# Altium schematic sheet Doggy.SchDoc
size A4
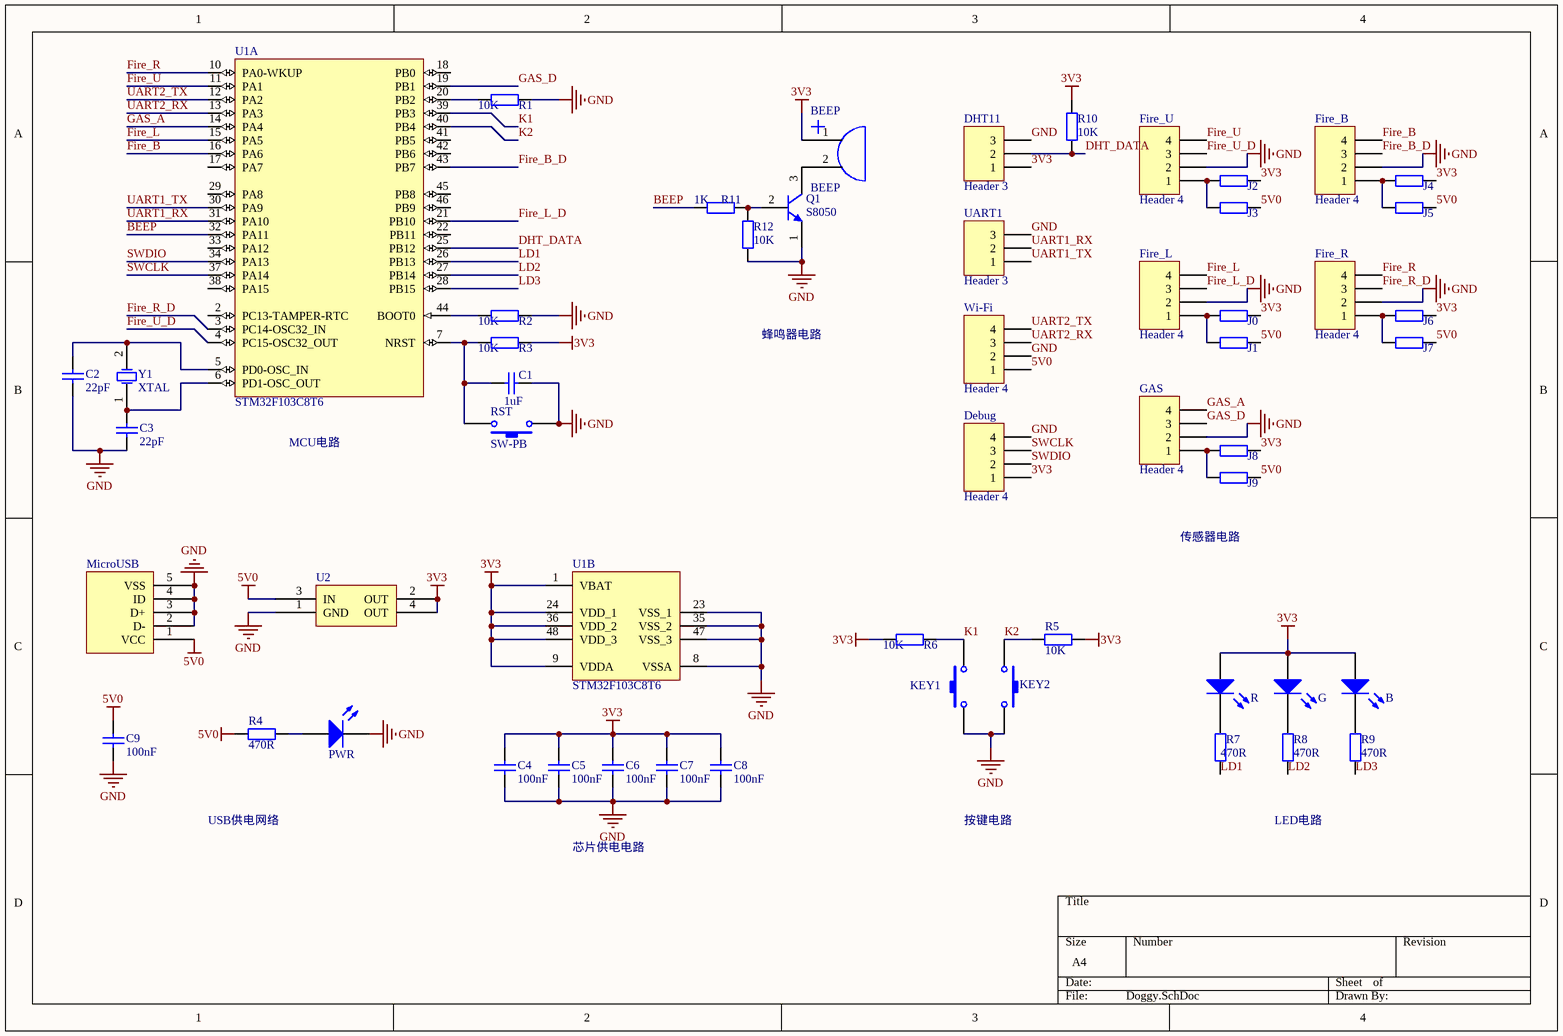
[diagram p0: Doggy.SchDoc]

## Parts
B  LED0  [LED_0805]  (value not drawn)
BEEP  BEEP  [Beep]
C1  value 1uF  [C-RAD-0805]  (hidden comment: Cap)
C2  value 22pF  [C-RAD-0805]  (hidden comment: Cap)
C3  value 22pF  [C-RAD-0805]  (hidden comment: Cap)
C4  value 100nF  [C-RAD-0805]  (hidden comment: Cap)
C5  value 100nF  [C-RAD-0805]  (hidden comment: Cap)
C6  value 100nF  [C-RAD-0805]  (hidden comment: Cap)
C7  value 100nF  [C-RAD-0805]  (hidden comment: Cap)
C8  value 100nF  [C-RAD-0805]  (hidden comment: Cap)
C9  value 100nF  [C-RAD-0805]  (hidden comment: Cap)
Debug  Header 4  [HDR1X4]
DHT11  Header 3  [HDR1X3]
Fire_B  Header 4  [HDR1X4]
Fire_L  Header 4  [HDR1X4]
Fire_R  Header 4  [HDR1X4]
Fire_U  Header 4  [HDR1X4]
G  LED0  [LED_0805]  (value not drawn)
GAS  Header 4  [HDR1X4]
J0  Res1  [0805-1]  (value not drawn)
J1  Res1  [0805-1]  (value not drawn)
J2  Res1  [0805-1]  (value not drawn)
J3  Res1  [0805-1]  (value not drawn)
J4  Res1  [0805-1]  (value not drawn)
J5  Res1  [0805-1]  (value not drawn)
J6  Res1  [0805-1]  (value not drawn)
J7  Res1  [0805-1]  (value not drawn)
J8  Res1  [0805-1]  (value not drawn)
J9  Res1  [0805-1]  (value not drawn)
KEY1  SW-PB  [SW_PB2_A1]  (value not drawn)
KEY2  SW-PB  [SW_PB2_A1]  (value not drawn)
MicroUSB  USB_M  [USB_MICRO]  (value not drawn)
PWR  LED0  [LED_0805]  (value not drawn)
Q1  S8050  [TO-92A]
R  LED0  [LED_0805]  (value not drawn)
R1  value 10K  [0805-1]  (hidden comment: Res1)
R2  value 10K  [0805-1]  (hidden comment: Res1)
R3  value 10K  [0805-1]  (hidden comment: Res1)
R4  value 470R  [0805-1]  (hidden comment: Res1)
R5  value 10K  [0805-1]  (hidden comment: Res1)
R6  value 10K  [0805-1]  (hidden comment: Res1)
R7  value 470R  [0805-1]  (hidden comment: Res1)
R8  value 470R  [0805-1]  (hidden comment: Res1)
R9  value 470R  [0805-1]  (hidden comment: Res1)
R10  value 10K  [0805-1]  (hidden comment: Res1)
R11  value 1K  [0805-1]  (hidden comment: Res1)
R12  value 10K  [0805-1]  (hidden comment: Res1)
RST  SW-PB  [SW_PB2_A1]
U1  STM32F103C8T6  [STM-LQFP48_N]  (parts A,B of 2)
U2  AMS1117-3.3  [SOT-223]  (value not drawn)
UART1  Header 3  [HDR1X3]
Wi-Fi  Header 4  [HDR1X4]
Y1  XTAL  [X-HC49U]

## Nets
3V3: B.1(A) BEEP.1 C4.2 C5.2 C6.2 C7.2 C8.2 Debug.1 DHT11.1 G.1(A) J0.2 J2.2 J4.2 J6.2 J8.2 R.1(A) R3.2 R5.1 R6.1 R10.2 U1.1(VBAT) U1.9(VDDA) U1.24(VDD_1) U1.36(VDD_2) U1.48(VDD_3) U2.2(OUT) U2.4(OUT)
5V0: C9.2 J1.2 J3.2 J5.2 J7.2 J9.2 MicroUSB.1(VCC) R4.1 U2.3(IN) Wi-Fi.1
GND: C1.1 C2.1 C3.1 C4.1 C5.1 C6.1 C7.1 C8.1 C9.1 Debug.4 DHT11.3 Fire_B.2 Fire_L.2 Fire_R.2 Fire_U.2 GAS.2 KEY1.1 KEY2.2 MicroUSB.2(D-) MicroUSB.3(D+) MicroUSB.4(ID) MicroUSB.5(VSS) PWR.2(K) Q1.1(E) R1.2 R2.2 R12.1 RST.1 U1.8(VSSA) U1.23(VSS_1) U1.35(VSS_2) U1.47(VSS_3) U2.1(GND) UART1.3 Wi-Fi.2
BEEP: R11.1 U1.32(PA11)
DHT_DATA: DHT11.2 R10.1 U1.25(PB12)
Fire_B: Fire_B.4 U1.16(PA6)
Fire_B_D: Fire_B.3 U1.43(PB7)
Fire_L: Fire_L.4 U1.15(PA5)
Fire_L_D: Fire_L.3 U1.21(PB10)
Fire_R: Fire_R.4 U1.10(PA0-WKUP)
Fire_R_D: Fire_R.3 U1.3(PC14-OSC32_IN)
Fire_U: Fire_U.4 U1.11(PA1)
Fire_U_D: Fire_U.3 U1.4(PC15-OSC32_OUT)
GAS_A: GAS.4 U1.14(PA4)
GAS_D: GAS.3 U1.19(PB1)
K1: KEY1.2 R6.2 U1.39(PB3)
K2: KEY2.1 R5.2 U1.40(PB4)
LD1: R7.1 U1.26(PB13)
LD2: R8.1 U1.27(PB14)
LD3: R9.1 U1.28(PB15)
SWCLK: Debug.3 U1.37(PA14)
SWDIO: Debug.2 U1.34(PA13)
UART1_RX: U1.31(PA10) UART1.2
UART1_TX: U1.30(PA9) UART1.1
UART2_RX: U1.13(PA3) Wi-Fi.3
UART2_TX: U1.12(PA2) Wi-Fi.4
NetB_2: B.2(K) R9.2
NetBEEP_2: BEEP.2 Q1.3(C)
NetC1_2: C1.2 R3.1 RST.2 U1.7(NRST)
NetC2_2: C2.2 U1.5(PD0-OSC_IN) Y1.2(OSC2)
NetC3_2: C3.2 U1.6(PD1-OSC_OUT) Y1.1(OSC1)
NetFire_B_1: Fire_B.1 J4.1 J5.1
NetFire_L_1: Fire_L.1 J0.1 J1.1
NetFire_R_1: Fire_R.1 J6.1 J7.1
NetFire_U_1: Fire_U.1 J2.1 J3.1
NetG_2: G.2(K) R8.2
NetGAS_1: GAS.1 J8.1 J9.1
NetPWR_1: PWR.1(A) R4.2
NetQ1_2: Q1.2(B) R11.2 R12.2
NetR1_1: R1.1 U1.20(PB2)
NetR2_1: R2.1 U1.44(BOOT0)
NetR_2: R.2(K) R7.2

Not connected (* = marked no-connect by the designer): U1 2(PC13-TAMPER-RTC) 17(PA7) 18(PB0) 22(PB11) 29(PA8) 33(PA12) 38(PA15) 41(PB5) 42(PB6) 45(PB8) 46(PB9)

## Notes on the sheet
- 蜂鸣器电路
- MCU电路
- 传感器电路
- USB供电网络
- 芯片供电电路
- 按键电路
- LED电路

## Library data of the parts
B G PWR R = LED0: 发光二极管; Published: 8-Jun-2000; LatestRevisionDate: 08-Jul-2005; LatestRevisionNote: Mech Layer 1 removed.; PackageReference: LED-0; Publisher: Altium Limited
BEEP = BEEP: 蜂鸣器
C1-C9 = Cap: 无极性电容; Published: 8-Jun-2000; LatestRevisionDate: 17-Jul-2002; LatestRevisionNote: Re-released for DXP Platform.; PackageReference: RAD-0.3; Publisher: Altium Limited
Debug Fire_B Fire_L Fire_R Fire_U GAS Wi-Fi = Header 4: Header, 4-Pin; LatestRevisionDate: 17-Jul-2002; LatestRevisionNote: Re-released for DXP Platform.; Publisher: Altium Limited
DHT11 UART1 = Header 3: Header, 3-Pin; LatestRevisionDate: 17-Jul-2002; LatestRevisionNote: Re-released for DXP Platform.; Publisher: Altium Limited
J0-J9 R1-R12 = Res1: 贴片电阻; Published: 8-Jun-2000; LatestRevisionDate: 17-Jul-2002; LatestRevisionNote: Re-released for DXP Platform.; PackageReference: AXIAL-0.4; Publisher: Altium Limited
KEY1 KEY2 RST = SW-PB: 微动开关; Published: 24-Mar-1999; LatestRevisionDate: 17-Jul-2002; LatestRevisionNote: Re-released for DXP Platform.; PackageReference: SPST-2; Publisher: Altium Limited
MicroUSB = USB_M: MicroUSB接口
Q1 = S8050: NPN三极管; Published: 8-Jun-2000; LatestRevisionDate: 15-Jan-2003; LatestRevisionNote: PCB Footprint 'BCY-W3/D4.7' replaced; DatasheetDocument: 1997; PackageDocument: Sep-1998; PackageReference: TO-92A; Publisher: Altium Limited; Code_JEDEC: TO-92A; ComponentLink1Description: Manufacturer Link; ComponentLink1URL: http://www.fairchildsemi.com/; ComponentLink2Description: Datasheet; ComponentLink2URL: http://www.fairchildsemi.com/ds/2N%2F2N3904.pdf
U1 = STM32F103C8T6: ARM Cortex-M3 32-bit MCU, 64 KB Flash, 20 KB Internal RAM, 37 I/Os, 48-pin LQFP, -40 to 85 degC, Tray; A/D Converter: 2x12-bit (10 Channel); FLASH Size (Prog) (kB): 64; I/Os (High Current): 37; Internal RAM Size (kB): 20; Operating Frequency(F) (Processor speed) (MHz): 72; Supply Voltage(Vcc) min (V): 2; DatasheetVersion: Rev. 16; PackageVersion: Rev. 6, 06/2013; PackageReference: LQFP48; PackageDescription: 48-Pin Low Profile Quad Flat Package, 7 x 7 mm Body, 0.5 mm Pitch; Supplier 1: Digi-Key; Supplier Part Number 1: 497-6063-ND; Supplier 2: Farnell; Supplier Part Number 2: 1447637; Supplier 3: Newark; Supplier Part Number 3: 59M2182; Supplier 4: Newark; Supplier Part Number 4: 57P1222; Supplier 5: Mouser; Supplier Part Number 5: 511-STM32F103C8T6; Core: ARM Cortex-M3; Packing: Tray; Mounting Technology: Surface Mount; PartNumber: STM32F103C8T6; ComponentLink1Description: Manufacturer URL; ComponentLink1URL: http://www.st.com/web/en/home.html; ComponentLink2Description: Datasheet; ComponentLink2URL: http://www.st.com/st-web-ui/static/active/en/resource/technical/document/datasheet/CD00161566.pdf; ComponentLink3Description: Package Specification; ComponentLink3URL: http://www.st.com/st-web-ui/static/active/en/resource/technical/document/datasheet/DM00058181.pdf
U2 = ASM1117: 3.3V稳压芯片
Y1 = XTAL: Crystal Oscillator; Published: 8-Jun-2000; LatestRevisionDate: 17-Jul-2002; LatestRevisionNote: Re-released for DXP Platform.; PackageReference: R38; Publisher: Altium Limited; PackageDescription: Crystal, Thru-Hole; 2 Leads; Body 3.1 x 8.2 mm (Dia.xH)